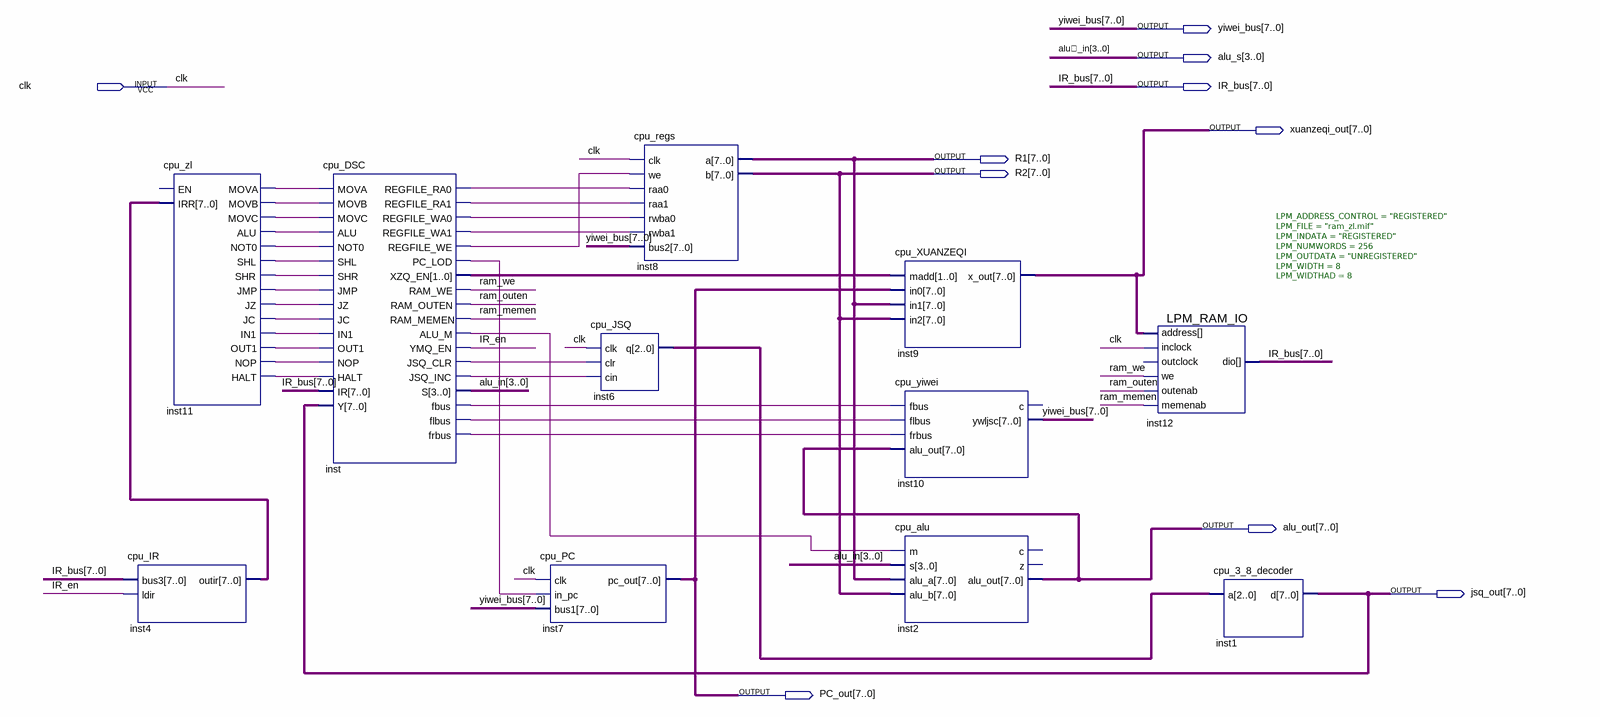
[diagram p0: schematic sheet]
// Quartus schematic cpu.bdf as structural Verilog: 11 symbols, 10 pins
module cpu (
  input  clk,
  output [7:0] yiwei_bus,
  output [3:0] alu_s,
  output [7:0] IR_bus,
  output [7:0] xuanzeqi_out,
  output [7:0] R1,
  output [7:0] R2,
  output [7:0] alu_out,
  output [7:0] jsq_out,
  output [7:0] PC_out
);

  wire inst11_alu, inst11_halt, inst11_in1, inst11_jc, inst11_jmp, inst11_jz, inst11_mova, inst11_movb,
       inst11_movc, inst11_nop, inst11_not0, inst11_out1, inst11_shl, inst11_shr, inst_alu_m, inst_fbus,
       inst_flbus, inst_frbus, inst_jsq_clr, inst_jsq_inc, inst_pc_lod, inst_regfile_ra0, inst_regfile_ra1,
       inst_regfile_wa0, inst_regfile_wa1, inst_regfile_we, IR_en, ram_memen, ram_outen, ram_we;
  wire [1:0] inst_xzq_en;
  wire [2:0] inst6_q;
  wire [3:0] alu_in;
  wire [7:0] inst4_outir;

  cpu_zl inst11 (
    .IRR(inst4_outir), .MOVA(inst11_mova), .MOVB(inst11_movb), .MOVC(inst11_movc), .ALU(inst11_alu),
    .NOT0(inst11_not0), .SHL(inst11_shl), .SHR(inst11_shr), .JMP(inst11_jmp), .JZ(inst11_jz), .JC(inst11_jc),
    .IN1(inst11_in1), .OUT1(inst11_out1), .NOP(inst11_nop), .HALT(inst11_halt));  // open: EN
  cpu_IR inst4 (.bus3(IR_bus), .ldir(IR_en), .outir(inst4_outir));
  cpu_DSC inst (
    .MOVA(inst11_mova), .MOVB(inst11_movb), .MOVC(inst11_movc), .ALU(inst11_alu), .NOT0(inst11_not0),
    .SHL(inst11_shl), .SHR(inst11_shr), .JMP(inst11_jmp), .JZ(inst11_jz), .JC(inst11_jc), .IN1(inst11_in1),
    .OUT1(inst11_out1), .NOP(inst11_nop), .HALT(inst11_halt), .IR(IR_bus), .Y(jsq_out),
    .REGFILE_RA0(inst_regfile_ra0), .REGFILE_RA1(inst_regfile_ra1), .REGFILE_WA0(inst_regfile_wa0),
    .REGFILE_WA1(inst_regfile_wa1), .REGFILE_WE(inst_regfile_we), .PC_LOD(inst_pc_lod), .XZQ_EN(inst_xzq_en),
    .RAM_WE(ram_we), .RAM_OUTEN(ram_outen), .RAM_MEMEN(ram_memen), .ALU_M(inst_alu_m), .YMQ_EN(IR_en),
    .JSQ_CLR(inst_jsq_clr), .JSQ_INC(inst_jsq_inc), .S(alu_in), .fbus(inst_fbus), .flbus(inst_flbus),
    .frbus(inst_frbus));
  cpu_PC inst7 (.clk(clk), .in_pc(inst_pc_lod), .bus1(yiwei_bus), .pc_out(PC_out));
  cpu_regs inst8 (
    .clk(clk), .we(inst_regfile_we), .raa0(inst_regfile_ra0), .raa1(inst_regfile_ra1),
    .rwba0(inst_regfile_wa0), .rwba1(inst_regfile_wa1), .bus2(yiwei_bus), .a(R1), .b(R2));
  cpu_JSQ inst6 (.clk(clk), .clr(inst_jsq_clr), .cin(inst_jsq_inc), .q(inst6_q));
  cpu_XUANZEQI inst9 (.madd(inst_xzq_en), .in0(PC_out), .in1(R1), .in2(R2), .x_out(xuanzeqi_out));
  cpu_yiwei inst10 (
    .fbus(inst_fbus), .flbus(inst_flbus), .frbus(inst_frbus), .alu_out(alu_out), .ywljsc(yiwei_bus));  // open: c
  cpu_alu inst2 (.m(inst_alu_m), .s(alu_in), .alu_a(R1), .alu_b(R2), .alu_out(alu_out));  // open: c, z
  LPM_RAM_IO #(.LPM_ADDRESS_CONTROL("REGISTERED"), .LPM_FILE("ram_zl.mif"), .LPM_INDATA("REGISTERED"), .LPM_NUMWORDS(256), .LPM_OUTDATA("UNREGISTERED"), .LPM_WIDTH(8), .LPM_WIDTHAD(8)) inst12 (
    .address(xuanzeqi_out), .memenab(ram_memen), .inclock(clk), .we(ram_we), .outenab(ram_outen), .dio(IR_bus));  // open: outclock
  cpu_3_8_decoder inst1 (.a(inst6_q), .d(jsq_out));

  // Other names for the same wires on the sheet: alu_in[3:0] = alu_s
endmodule
